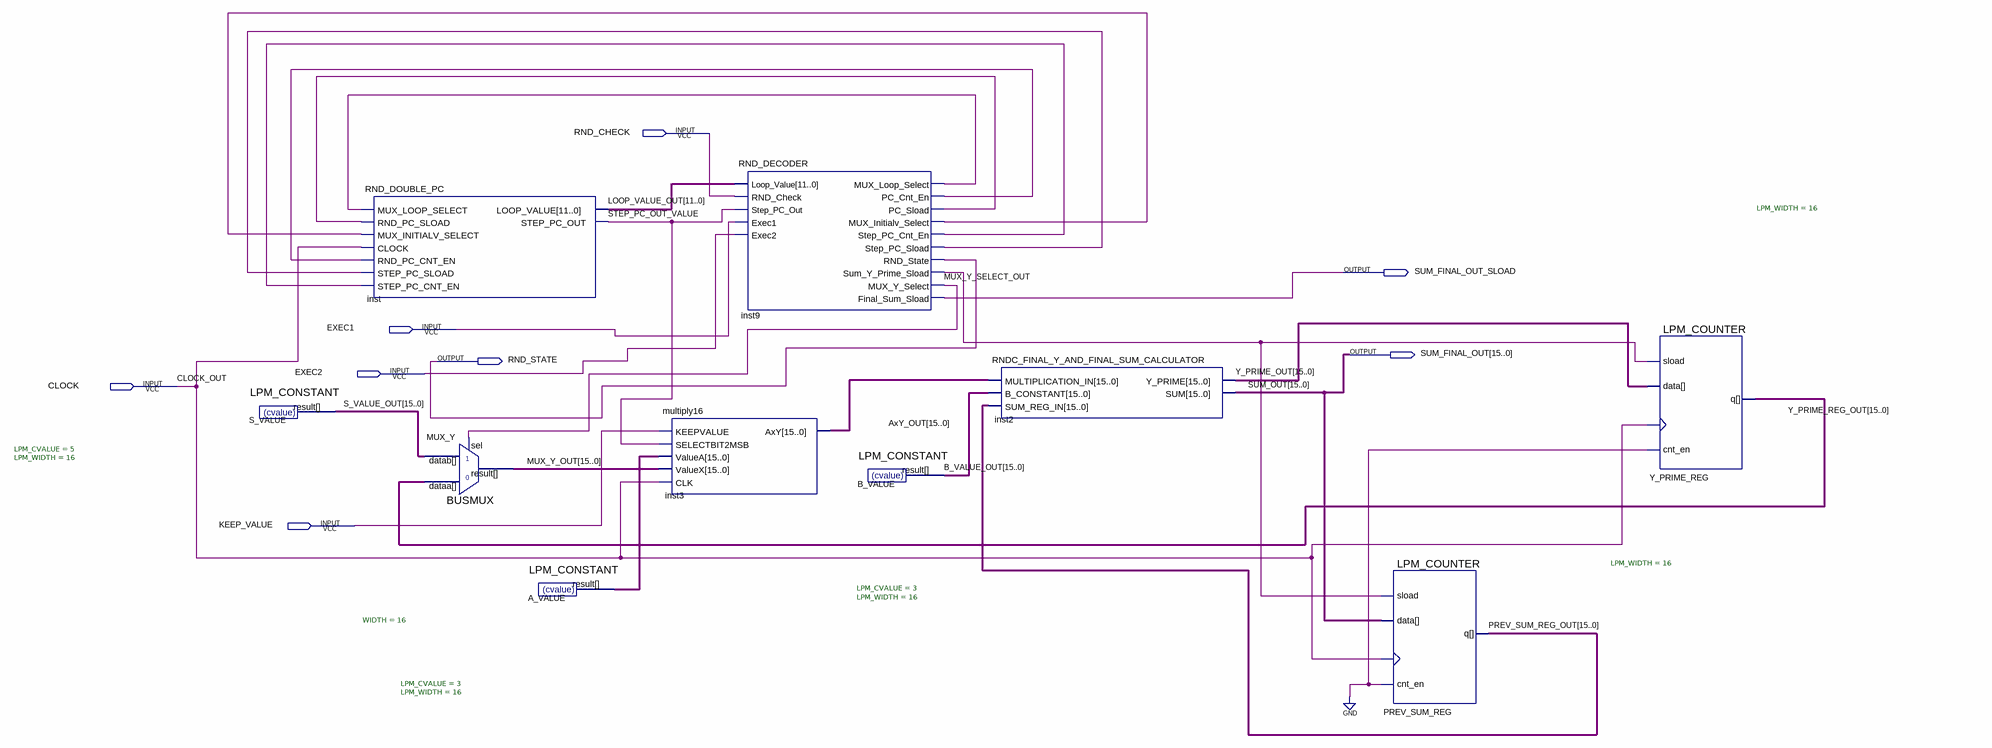
[diagram p0: schematic sheet]
// Quartus schematic RND_Project_V1.bdf as structural Verilog: 10 symbols, 8 pins
module RND_Project_V1 (
  input  RND_CHECK,
  input  EXEC1,
  input  EXEC2,
  input  CLOCK,
  input  KEEP_VALUE,
  output SUM_FINAL_OUT_SLOAD,
  output [15:0] SUM_FINAL_OUT,
  output RND_STATE
);

  wire inst9_mux_initialv_select, inst9_mux_loop_select, inst9_pc_cnt_en, inst9_pc_sload,
       inst9_step_pc_cnt_en, inst9_step_pc_sload, inst9_sum_y_prime_sload, MUX_Y_SELECT_OUT,
       STEP_PC_OUT_VALUE;
  wire [11:0] LOOP_VALUE_OUT;
  wire [15:0] A_VALUE_result, AxY_OUT, B_VALUE_OUT, MUX_Y_OUT, PREV_SUM_REG_OUT, S_VALUE_OUT, Y_PRIME_OUT,
       Y_PRIME_REG_OUT;

  LPM_CONSTANT #(.LPM_CVALUE(5), .LPM_WIDTH(16)) S_VALUE (.result(S_VALUE_OUT));
  RND_DOUBLE_PC inst (
    .MUX_LOOP_SELECT(inst9_mux_loop_select), .RND_PC_SLOAD(inst9_pc_sload),
    .MUX_INITIALV_SELECT(inst9_mux_initialv_select), .CLOCK(CLOCK), .RND_PC_CNT_EN(inst9_pc_cnt_en),
    .STEP_PC_SLOAD(inst9_step_pc_sload), .STEP_PC_CNT_EN(inst9_step_pc_cnt_en), .LOOP_VALUE(LOOP_VALUE_OUT),
    .STEP_PC_OUT(STEP_PC_OUT_VALUE));
  BUSMUX #(.WIDTH(16)) MUX_Y (.datab(S_VALUE_OUT), .sel(MUX_Y_SELECT_OUT), .dataa(Y_PRIME_REG_OUT), .result(MUX_Y_OUT));
  LPM_CONSTANT #(.LPM_CVALUE(3), .LPM_WIDTH(16)) A_VALUE (.result(A_VALUE_result));
  multiply16 inst3 (
    .KEEPVALUE(KEEP_VALUE), .SELECTBIT2MSB(STEP_PC_OUT_VALUE), .ValueA(A_VALUE_result), .ValueX(MUX_Y_OUT),
    .CLK(CLOCK), .AxY(AxY_OUT));
  RND_DECODER inst9 (
    .Loop_Value(LOOP_VALUE_OUT), .RND_Check(RND_CHECK), .Step_PC_Out(STEP_PC_OUT_VALUE), .Exec1(EXEC1),
    .Exec2(EXEC2), .MUX_Loop_Select(inst9_mux_loop_select), .PC_Cnt_En(inst9_pc_cnt_en),
    .PC_Sload(inst9_pc_sload), .MUX_Initialv_Select(inst9_mux_initialv_select),
    .Step_PC_Cnt_En(inst9_step_pc_cnt_en), .Step_PC_Sload(inst9_step_pc_sload), .RND_State(RND_STATE),
    .Sum_Y_Prime_Sload(inst9_sum_y_prime_sload), .MUX_Y_Select(MUX_Y_SELECT_OUT),
    .Final_Sum_Sload(SUM_FINAL_OUT_SLOAD));
  LPM_CONSTANT #(.LPM_CVALUE(3), .LPM_WIDTH(16)) B_VALUE (.result(B_VALUE_OUT));
  RNDC_FINAL_Y_AND_FINAL_SUM_CALCULATOR inst2 (
    .MULTIPLICATION_IN(AxY_OUT), .B_CONSTANT(B_VALUE_OUT), .SUM_REG_IN(PREV_SUM_REG_OUT),
    .Y_PRIME(Y_PRIME_OUT), .SUM(SUM_FINAL_OUT));
  LPM_COUNTER #(.LPM_WIDTH(16)) PREV_SUM_REG (
    .clock(CLOCK), .cnt_en(1'b0), .data(SUM_FINAL_OUT), .sload(inst9_sum_y_prime_sload), .q(PREV_SUM_REG_OUT));
  LPM_COUNTER #(.LPM_WIDTH(16)) Y_PRIME_REG (
    .clock(CLOCK), .cnt_en(1'b0), .data(Y_PRIME_OUT), .sload(inst9_sum_y_prime_sload), .q(Y_PRIME_REG_OUT));

  // Other names for the same wires on the sheet: CLOCK_OUT = CLOCK; SUM_OUT[15:0] = SUM_FINAL_OUT
endmodule
